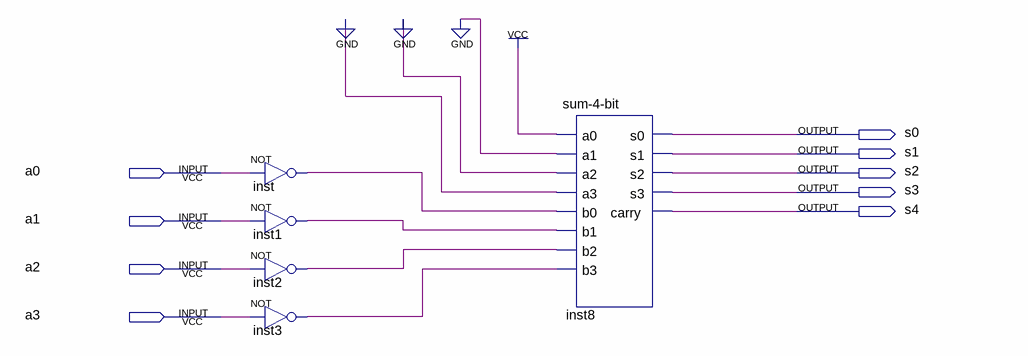
[diagram p0: schematic sheet]
// Quartus schematic compl-2-sd.bdf as structural Verilog: 5 symbols, 9 pins
module \compl-2-sd  (
  input  a0,
  input  a1,
  input  a2,
  input  a3,
  output s0,
  output s1,
  output s2,
  output s3,
  output s4
);

  wire inst1_out, inst2_out, inst3_out, inst_out;

  not inst (inst_out, a0);
  not inst1 (inst1_out, a1);
  not inst2 (inst2_out, a2);
  not inst3 (inst3_out, a3);
  \sum-4-bit  inst8 (
    .a0(1'b1), .a1(1'b0), .a2(1'b0), .a3(1'b0), .b0(inst_out), .b1(inst1_out), .b2(inst2_out),
    .b3(inst3_out), .s0(s0), .s1(s1), .s2(s2), .s3(s3), .carry(s4));
endmodule
